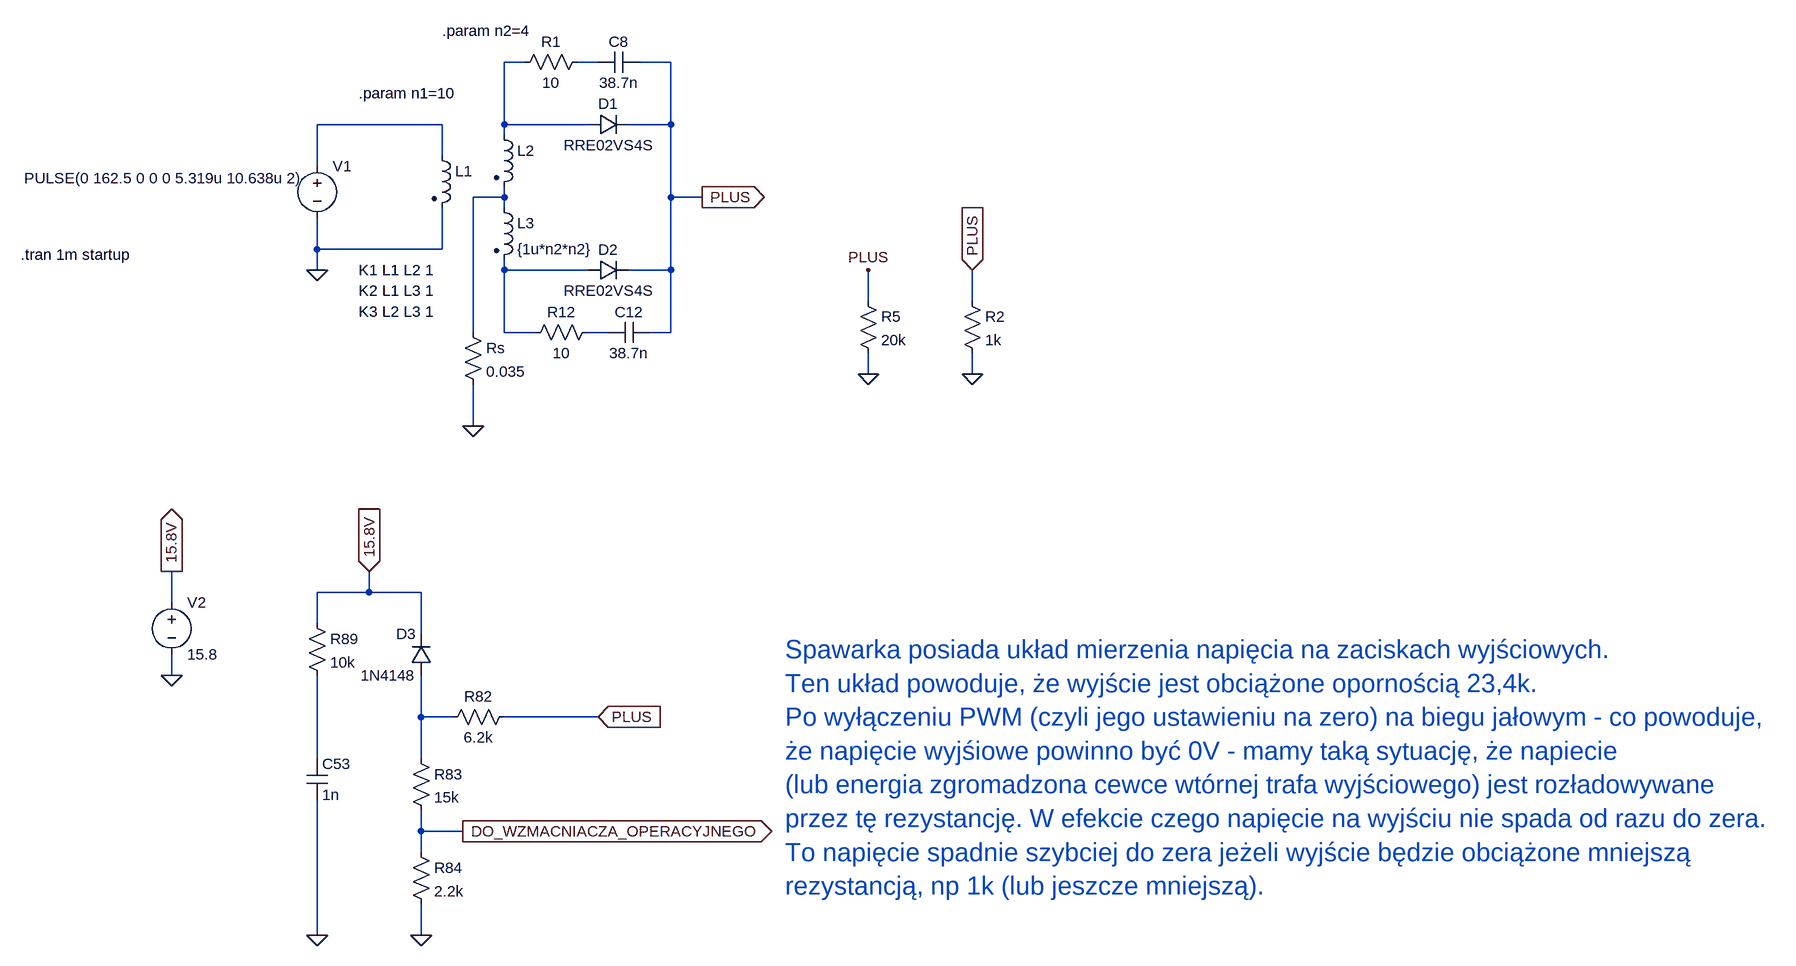
[diagram p0: schematic output_trafo.asc]
output_trafo.asc, the LTspice schematic file:
Version 4
SHEET 1 2256 1332
WIRE 272 -32 240 -32
WIRE 384 -32 352 -32
WIRE 496 -32 448 -32
WIRE 144 64 -48 64
WIRE 240 64 240 -32
WIRE 368 64 240 64
WIRE 496 64 496 -32
WIRE 496 64 432 64
WIRE 240 80 240 64
WIRE 144 112 144 64
WIRE -48 128 -48 64
WIRE 240 176 240 160
WIRE 240 176 192 176
WIRE 496 176 496 64
WIRE 544 176 496 176
WIRE 240 192 240 176
WIRE -48 256 -48 208
WIRE 144 256 144 192
WIRE 144 256 -48 256
WIRE -48 288 -48 256
WIRE 240 288 240 272
WIRE 368 288 240 288
WIRE 496 288 496 176
WIRE 496 288 432 288
WIRE 800 336 800 288
WIRE 960 336 960 288
WIRE 192 384 192 176
WIRE 240 384 240 288
WIRE 288 384 240 384
WIRE 400 384 368 384
WIRE 496 384 496 288
WIRE 496 384 464 384
WIRE 800 448 800 416
WIRE 960 448 960 416
WIRE 192 528 192 464
WIRE 32 784 32 752
WIRE 32 784 -48 784
WIRE 112 784 32 784
WIRE -272 800 -272 752
WIRE -48 832 -48 784
WIRE 112 848 112 784
WIRE -272 912 -272 880
WIRE 112 976 112 912
WIRE 160 976 112 976
WIRE 384 976 240 976
WIRE -48 1040 -48 912
WIRE 112 1040 112 976
WIRE 112 1152 112 1120
WIRE 176 1152 112 1152
WIRE 112 1184 112 1152
WIRE -48 1312 -48 1104
WIRE 112 1312 112 1264
FLAG -48 288 0
FLAG 544 176 PLUS
IOPIN 544 176 Out
FLAG 192 528 0
FLAG 112 1312 0
FLAG 384 976 PLUS
IOPIN 384 976 In
FLAG 800 448 0
FLAG 800 288 PLUS
FLAG -272 912 0
FLAG -272 752 15.8V
IOPIN -272 752 Out
FLAG 32 752 15.8V
IOPIN 32 752 In
FLAG -48 1312 0
FLAG 176 1152 DO_WZMACNIACZA_OPERACYJNEGO
IOPIN 176 1152 Out
FLAG 960 448 0
FLAG 960 288 PLUS
IOPIN 960 288 In
SYMBOL ind2 128 96 R0
WINDOW 3 -95 -12 Invisible 2
SYMATTR Value {1u*n1*n1}
SYMATTR InstName L1
SYMATTR Type ind
SYMATTR SpiceLine Rser=0.001
SYMBOL ind2 224 64 R0
WINDOW 3 34 -5 Invisible 2
SYMATTR Value {1u*n2*n2}
SYMATTR InstName L2
SYMATTR Type ind
SYMATTR SpiceLine Rser=0.001
SYMBOL ind2 224 176 R0
SYMATTR Value {1u*n2*n2}
SYMATTR InstName L3
SYMATTR Type ind
SYMATTR SpiceLine Rser=0.001
SYMBOL voltage -48 112 R0
WINDOW 3 -451 35 Left 2
WINDOW 123 0 0 Left 0
WINDOW 39 0 0 Left 0
SYMATTR Value PULSE(0 162.5 0 0 0 5.319u 10.638u 2)
SYMATTR InstName V1
SYMBOL diode 368 80 R270
WINDOW 0 32 32 VTop 2
WINDOW 3 0 32 VBottom 2
SYMATTR InstName D1
SYMATTR Value RRE02VS4S
SYMBOL diode 368 304 R270
WINDOW 0 32 32 VTop 2
WINDOW 3 0 32 VBottom 2
SYMATTR InstName D2
SYMATTR Value RRE02VS4S
SYMBOL res 368 -48 R90
WINDOW 0 0 56 VBottom 2
WINDOW 3 32 56 VTop 2
SYMATTR InstName R1
SYMATTR Value 10
SYMBOL res 384 368 R90
WINDOW 0 0 56 VBottom 2
WINDOW 3 32 56 VTop 2
SYMATTR InstName R12
SYMATTR Value 10
SYMBOL cap 448 -48 R90
WINDOW 0 0 32 VBottom 2
WINDOW 3 32 32 VTop 2
SYMATTR InstName C8
SYMATTR Value 38.7n
SYMBOL cap 464 368 R90
WINDOW 0 0 32 VBottom 2
WINDOW 3 32 32 VTop 2
SYMATTR InstName C12
SYMATTR Value 38.7n
SYMBOL res 256 960 R90
WINDOW 0 0 56 VBottom 2
WINDOW 3 32 56 VTop 2
SYMATTR InstName R82
SYMATTR Value 6.2k
SYMBOL res 176 368 R0
SYMATTR InstName Rs
SYMATTR Value 0.035
SYMBOL res 96 1024 R0
SYMATTR InstName R83
SYMATTR Value 15k
SYMBOL res 96 1168 R0
SYMATTR InstName R84
SYMATTR Value 2.2k
SYMBOL res 784 320 R0
SYMATTR InstName R5
SYMATTR Value 20k
SYMBOL voltage -272 784 R0
WINDOW 123 0 0 Left 0
WINDOW 39 0 0 Left 0
SYMATTR InstName V2
SYMATTR Value 15.8
SYMBOL diode 128 912 R180
WINDOW 0 24 64 Left 2
WINDOW 3 24 0 Left 2
SYMATTR InstName D3
SYMATTR Value 1N4148
SYMBOL res -64 816 R0
SYMATTR InstName R89
SYMATTR Value 10k
SYMBOL cap -64 1040 R0
SYMATTR InstName C53
SYMATTR Value 1n
SYMBOL res 944 320 R0
SYMATTR InstName R2
SYMATTR Value 1k
TEXT 16 16 Left 2 !.param n1=10
TEXT 144 -80 Left 2 !.param n2=4
TEXT -504 264 Left 2 !.tran 1m startup
TEXT 16 288 Left 2 !K1 L1 L2 1
TEXT 16 320 Left 2 !K2 L1 L3 1
TEXT 16 352 Left 2 !K3 L2 L3 1
TEXT 672 872 Left 4 ;Spawarka posiada układ mierzenia napięcia na zaciskach wyjściowych.\nTen układ powoduje, że wyjście jest obciążone opornością 23,4k.\nPo wyłączeniu PWM (czyli jego ustawieniu na zero) na biegu jałowym - co powoduje,\nże napięcie wyjśiowe powinno być 0V - mamy taką sytuację, że napiecie\n(lub energia zgromadzona cewce wtórnej trafa wyjściowego) jest rozładowywane\nprzez tę rezystancję. W efekcie czego napięcie na wyjściu nie spada od razu do zera.\nTo napięcie spadnie szybciej do zera jeżeli wyjście będzie obciążone mniejszą\nrezystancją, np 1k (lub jeszcze mniejszą).

The netlist it stands for:
* output_trafo.asc
L1 N003 0 {1u*n1*n1} Rser=0.001
L2 N001 N004 {1u*n2*n2} Rser=0.001
L3 N004 N005 {1u*n2*n2} Rser=0.001
V1 N003 0 PULSE(0 162.5 0 0 0 5.319u 10.638u 2)
D1 N001 PLUS RRE02VS4S
D2 N005 PLUS RRE02VS4S
R1 N002 N001 10
R12 N006 N005 10
C8 PLUS N002 38.7n
C12 PLUS N006 38.7n
R82 PLUS N007 6.2k
Rs N004 0 0.035
R83 N007 DO_WZMACNIACZA_OPERACYJNEGO 15k
R84 DO_WZMACNIACZA_OPERACYJNEGO 0 2.2k
R5 PLUS 0 20k
V2 15.8V 0 15.8
D3 N007 15.8V 1N4148
R89 15.8V N008 10k
C53 N008 0 1n
R2 PLUS 0 1k
.model D D
.lib standard.dio
.param n1=10
.param n2=4
.tran 1m startup
K1 L1 L2 1
K2 L1 L3 1
K3 L2 L3 1
* Spawarka posiada układ mierzenia napięcia na zaciskach wyjściowych.
* Ten układ powoduje, że wyjście jest obciążone opornością 23,4k.
* Po wyłączeniu PWM (czyli jego ustawieniu na zero) na biegu jałowym - co powoduje,
* że napięcie wyjśiowe powinno być 0V - mamy taką sytuację, że napiecie
* (lub energia zgromadzona cewce wtórnej trafa wyjściowego) jest rozładowywane
* przez tę rezystancję. W efekcie czego napięcie na wyjściu nie spada od razu do zera.
* To napięcie spadnie szybciej do zera jeżeli wyjście będzie obciążone mniejszą
* rezystancją, np 1k (lub jeszcze mniejszą).
.backanno
.end